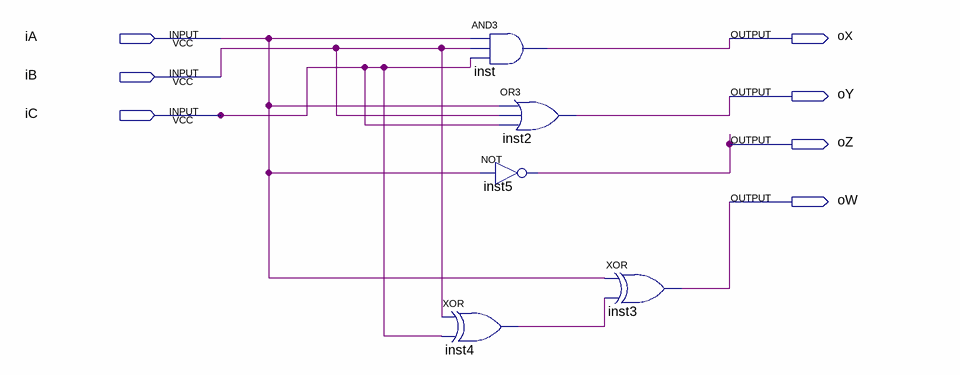
[diagram p0: schematic sheet]
// Quartus schematic Ejercicio8.bdf as structural Verilog: 5 symbols, 7 pins
module Ejercicio8 (
  input  iA,
  input  iB,
  input  iC,
  output oX,
  output oY,
  output oZ,
  output oW
);

  wire inst4_out;

  and inst (oX, iA, iB, iC);
  not inst5 (oZ, iA);
  xor inst4 (inst4_out, iB, iC);
  or inst2 (oY, iA, iB, iC);
  xor inst3 (oW, iA, inst4_out);
endmodule
